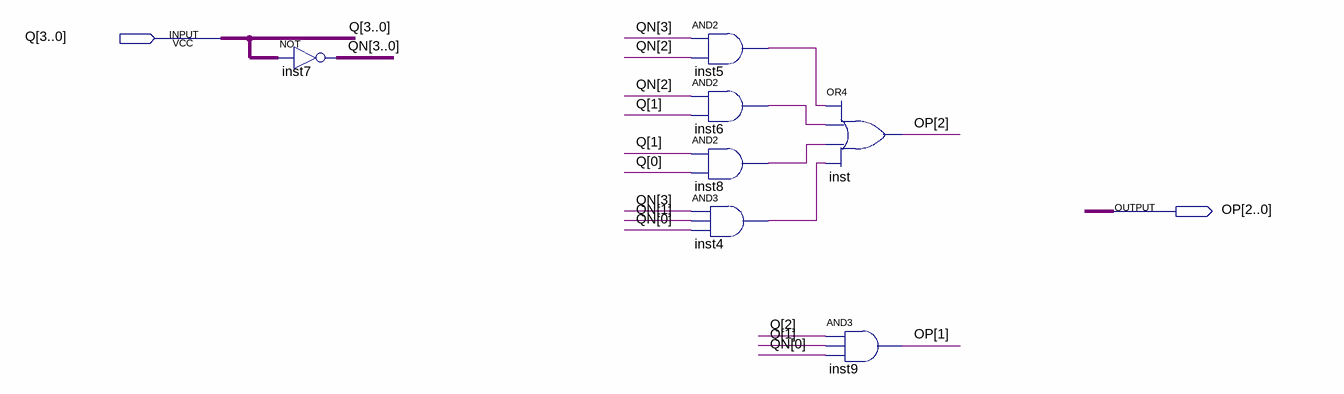
[diagram p0: schematic sheet]
// Quartus schematic OP.bdf as structural Verilog: 7 symbols, 2 pins
module OP (
  input  [3:0] Q,
  output [2:0] OP
);

  wire inst4_out, inst5_out, inst6_out, inst8_out;
  wire [3:0] QN;

  assign QN = ~Q;  // NOT inst7, 4 bits wide
  and inst5 (inst5_out, QN[3], QN[2]);
  and inst6 (inst6_out, QN[2], Q[1]);
  and inst8 (inst8_out, Q[1], Q[0]);
  and inst4 (inst4_out, QN[3], QN[1], QN[0]);
  or inst (OP[2], inst5_out, inst6_out, inst8_out, inst4_out);
  and inst9 (OP[1], Q[2], Q[1], QN[0]);
endmodule
